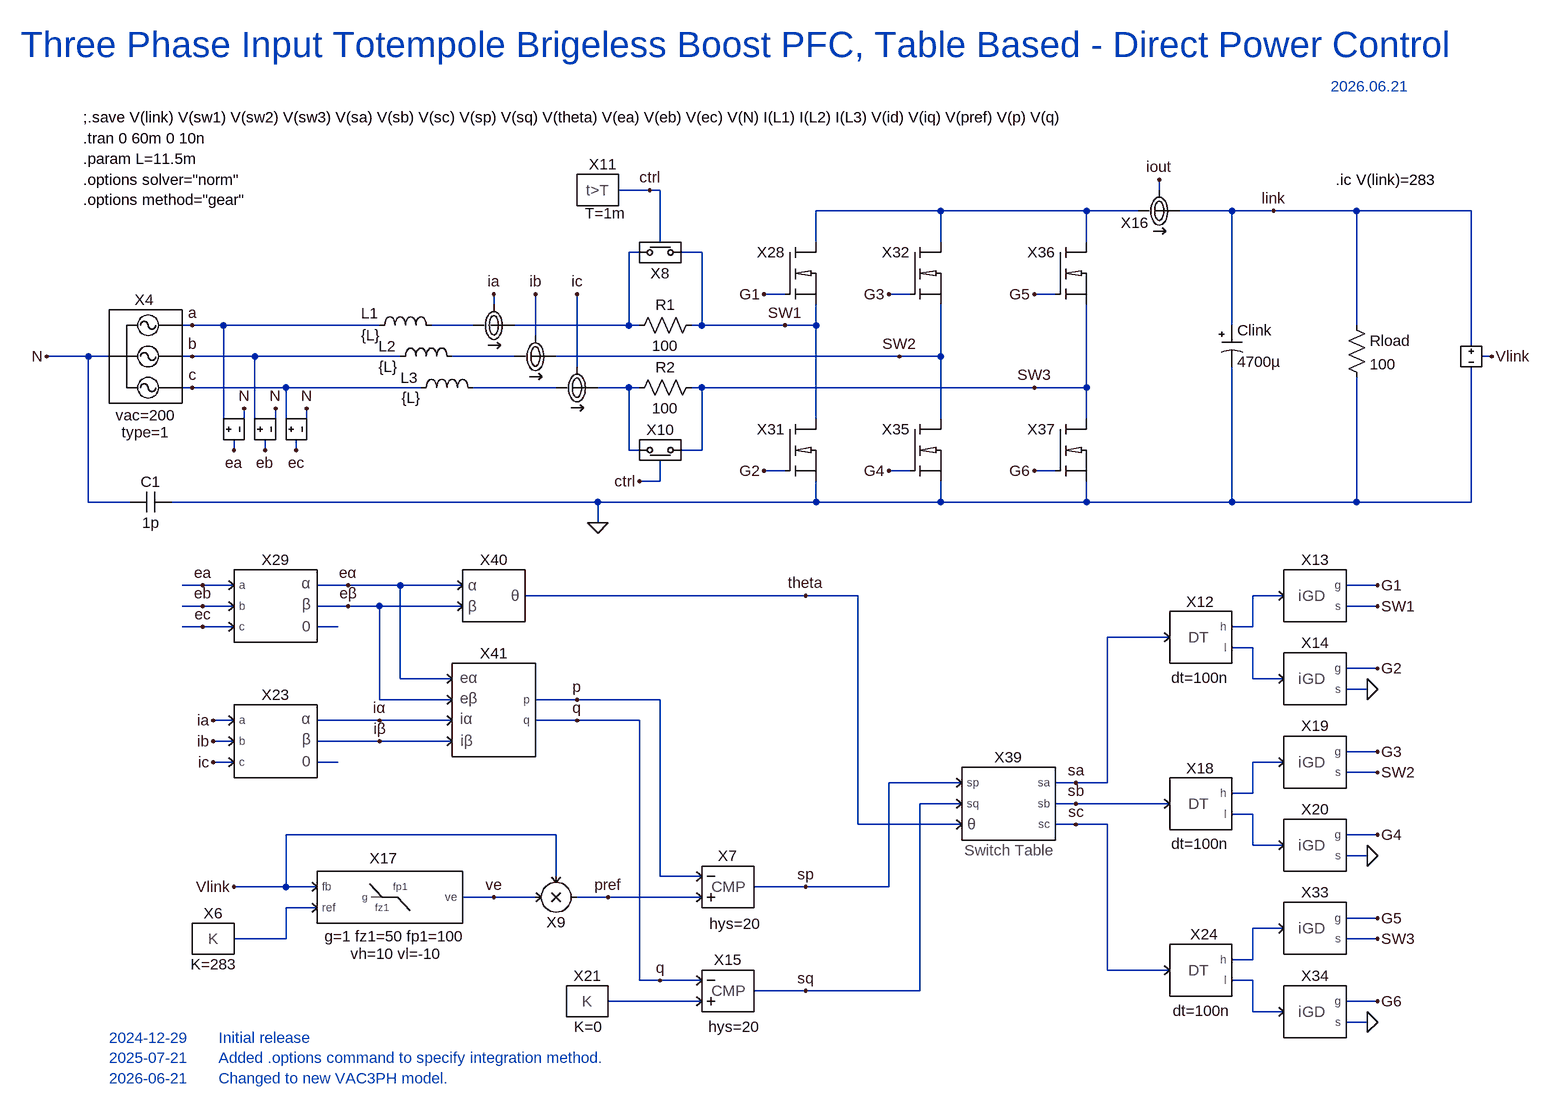
[diagram p0: schematic 3Ph-TTP-PFC_TB-DPC.asc]
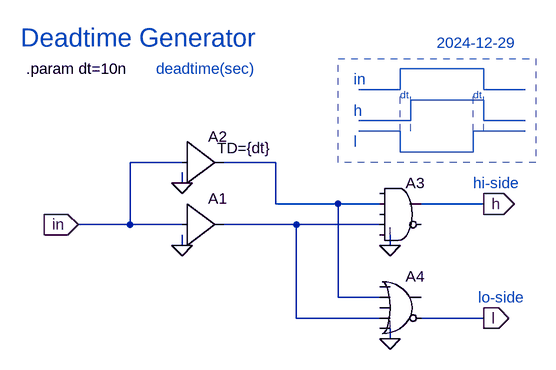
[diagram p1: sub-circuit deadtime.asc]
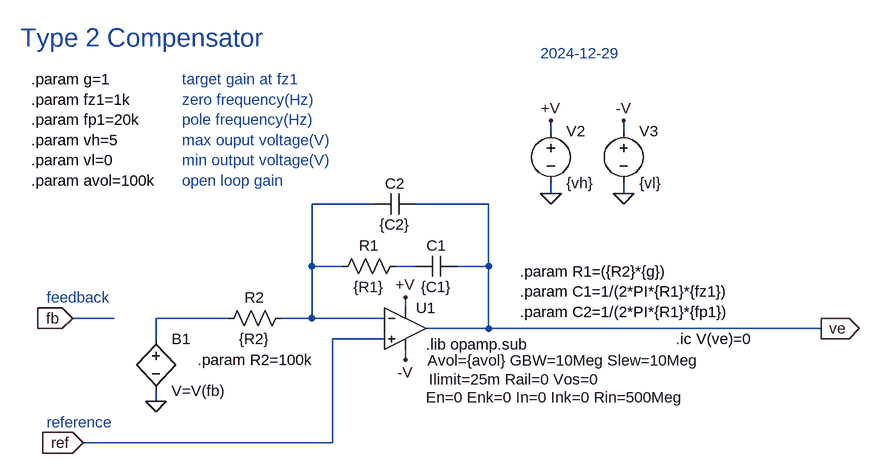
[diagram p2: sub-circuit type2.asc]
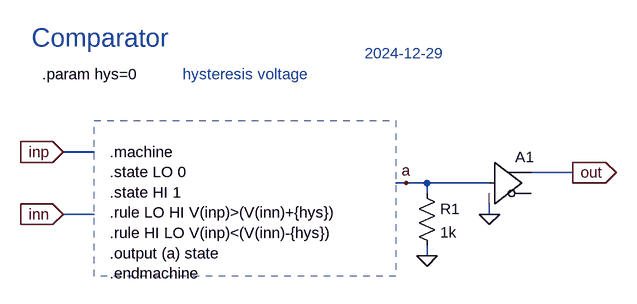
[diagram p3: sub-circuit cmp.asc]
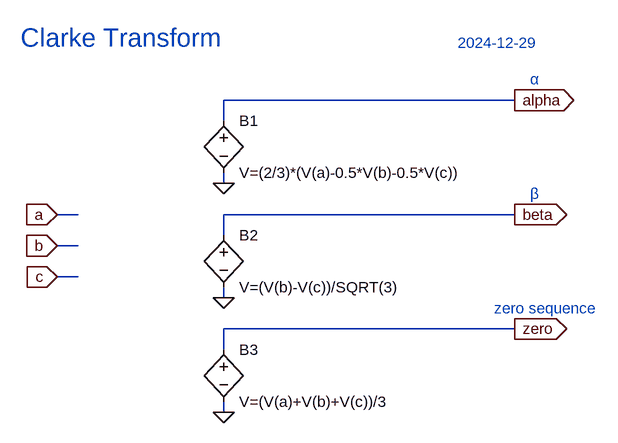
[diagram p4: sub-circuit clarke.asc]
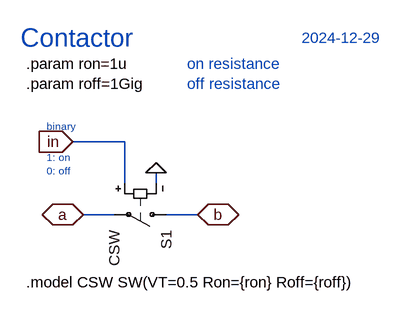
[diagram p5: sub-circuit contactor.asc]
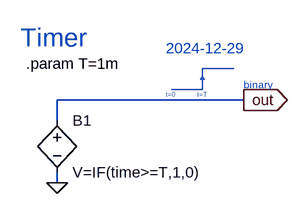
[diagram p6: sub-circuit timer.asc]
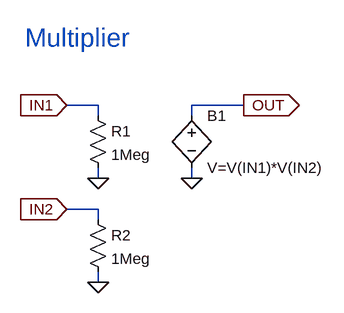
[diagram p7: sub-circuit mul.asc]
3Ph-TTP-PFC_TB-DPC.asc, the LTspice schematic file:
Version 4.1
SHEET 1 2416 2284
WIRE 336 -160 288 -160
WIRE 352 -160 336 -160
WIRE 1120 -160 1120 -176
WIRE 784 -128 592 -128
WIRE 1008 -128 784 -128
WIRE 1088 -128 1008 -128
WIRE 1232 -128 1152 -128
WIRE 1296 -128 1232 -128
WIRE 1424 -128 1296 -128
WIRE 1600 -128 1424 -128
WIRE 352 -80 352 -160
WIRE 592 -80 592 -128
WIRE 784 -80 784 -128
WIRE 1008 -80 1008 -128
WIRE 320 -64 304 -64
WIRE 416 -64 384 -64
WIRE 544 0 512 0
WIRE 736 0 704 0
WIRE 960 0 928 0
WIRE 96 16 96 0
WIRE -368 48 -384 48
WIRE -320 48 -368 48
WIRE -80 48 -320 48
WIRE 64 48 0 48
WIRE 304 48 304 -64
WIRE 304 48 128 48
WIRE 320 48 304 48
WIRE 416 48 416 -64
WIRE 416 48 400 48
WIRE 544 48 416 48
WIRE 592 48 592 16
WIRE 592 48 544 48
WIRE 1232 48 1232 -128
WIRE 1424 48 1424 -128
WIRE 160 64 160 0
WIRE 1600 80 1600 -128
WIRE -528 96 -592 96
WIRE -496 96 -528 96
WIRE -368 96 -384 96
WIRE -272 96 -368 96
WIRE -48 96 -272 96
WIRE 128 96 32 96
WIRE 720 96 192 96
WIRE 784 96 784 16
WIRE 784 96 720 96
WIRE 1632 96 1616 96
WIRE 224 112 224 0
WIRE -368 144 -384 144
WIRE -224 144 -368 144
WIRE -16 144 -224 144
WIRE 192 144 64 144
WIRE 304 144 256 144
WIRE 320 144 304 144
WIRE 416 144 400 144
WIRE 928 144 416 144
WIRE 1008 144 1008 16
WIRE 1008 144 928 144
WIRE 592 192 592 48
WIRE 784 192 784 96
WIRE 1008 192 1008 144
WIRE -320 208 -320 48
WIRE -288 208 -288 176
WIRE -272 208 -272 96
WIRE -240 208 -240 176
WIRE -224 208 -224 144
WIRE -192 208 -192 176
WIRE -304 240 -304 224
WIRE -256 240 -256 224
WIRE -208 240 -208 224
WIRE 304 240 304 144
WIRE 320 240 304 240
WIRE 416 240 416 144
WIRE 416 240 384 240
WIRE 544 272 512 272
WIRE 736 272 704 272
WIRE 960 272 928 272
WIRE 352 288 352 256
WIRE 352 288 320 288
WIRE -528 320 -528 96
WIRE -464 320 -528 320
WIRE 256 320 -400 320
WIRE 592 320 592 288
WIRE 592 320 256 320
WIRE 784 320 784 288
WIRE 784 320 592 320
WIRE 1008 320 1008 288
WIRE 1008 320 784 320
WIRE 1232 320 1232 112
WIRE 1232 320 1008 320
WIRE 1424 320 1424 128
WIRE 1424 320 1232 320
WIRE 1600 320 1600 112
WIRE 1600 320 1424 320
WIRE 256 352 256 320
WIRE -352 448 -384 448
WIRE -304 448 -352 448
WIRE -128 448 -176 448
WIRE -48 448 -128 448
WIRE 48 448 -48 448
WIRE 1456 448 1408 448
WIRE 576 464 144 464
WIRE 656 464 576 464
WIRE 1312 464 1264 464
WIRE -352 480 -384 480
WIRE -304 480 -352 480
WIRE -128 480 -176 480
WIRE -80 480 -128 480
WIRE 48 480 -80 480
WIRE 1456 480 1408 480
WIRE -352 512 -384 512
WIRE -304 512 -352 512
WIRE -144 512 -176 512
WIRE 1264 512 1264 464
WIRE 1264 512 1232 512
WIRE 1136 528 1040 528
WIRE 1264 544 1232 544
WIRE 1456 576 1408 576
WIRE -48 592 -48 448
WIRE 32 592 -48 592
WIRE 1264 592 1264 544
WIRE 1312 592 1264 592
WIRE 1440 608 1408 608
WIRE -80 624 -80 480
WIRE 32 624 -80 624
WIRE 224 624 160 624
WIRE 352 624 224 624
WIRE -304 656 -336 656
WIRE -80 656 -176 656
WIRE 32 656 -80 656
WIRE 224 656 160 656
WIRE 320 656 224 656
WIRE -304 688 -336 688
WIRE -80 688 -176 688
WIRE 32 688 -80 688
WIRE 1456 704 1408 704
WIRE -304 720 -336 720
WIRE -144 720 -176 720
WIRE 1312 720 1264 720
WIRE 1456 736 1408 736
WIRE 816 752 704 752
WIRE 992 752 960 752
WIRE 1040 752 1040 528
WIRE 1040 752 992 752
WIRE 1264 768 1264 720
WIRE 1264 768 1232 768
WIRE 816 784 752 784
WIRE 992 784 960 784
WIRE 1136 784 992 784
WIRE 1264 800 1232 800
WIRE 656 816 656 464
WIRE 816 816 656 816
WIRE 992 816 960 816
WIRE 1040 816 992 816
WIRE 192 832 -224 832
WIRE 1456 832 1408 832
WIRE 1264 848 1264 800
WIRE 1312 848 1264 848
WIRE 1440 864 1408 864
WIRE 192 896 192 832
WIRE 352 896 352 624
WIRE 416 896 352 896
WIRE -224 912 -224 832
WIRE -224 912 -304 912
WIRE -176 912 -224 912
WIRE 576 912 496 912
WIRE 704 912 704 752
WIRE 704 912 576 912
WIRE 96 928 48 928
WIRE 160 928 96 928
WIRE 272 928 224 928
WIRE 416 928 272 928
WIRE -176 944 -224 944
WIRE 1456 960 1408 960
WIRE 1312 976 1264 976
WIRE -224 992 -224 944
WIRE -224 992 -304 992
WIRE 1456 992 1408 992
WIRE 1264 1024 1264 976
WIRE 1264 1024 1232 1024
WIRE 1040 1040 1040 816
WIRE 1136 1040 1040 1040
WIRE 320 1056 320 656
WIRE 352 1056 320 1056
WIRE 416 1056 352 1056
WIRE 1264 1056 1232 1056
WIRE 576 1072 496 1072
WIRE 752 1072 752 784
WIRE 752 1072 576 1072
WIRE 416 1088 272 1088
WIRE 1456 1088 1408 1088
WIRE 1264 1104 1264 1056
WIRE 1312 1104 1264 1104
WIRE 1440 1120 1408 1120
FLAG 512 0 G1
FLAG 512 272 G2
FLAG 544 48 SW1
FLAG 1296 -128 link
FLAG 96 0 ia
FLAG 1632 96 Vlink
FLAG 256 352 0
FLAG 1120 -176 iout
FLAG 704 0 G3
FLAG 704 272 G4
FLAG 720 96 SW2
FLAG 928 0 G5
FLAG 928 272 G6
FLAG 928 144 SW3
FLAG 160 0 ib
FLAG -368 48 a
FLAG -368 96 b
FLAG -368 144 c
FLAG -592 96 N
FLAG 1456 448 G1
FLAG 1456 480 SW1
FLAG 1456 576 G2
FLAG 1456 704 G3
FLAG 1456 736 SW2
FLAG 1456 832 G4
FLAG 1456 960 G5
FLAG 1456 992 SW3
FLAG 1456 1088 G6
FLAG 1440 608 0
FLAG 1440 1120 0
FLAG 1440 864 0
FLAG 992 752 sa
FLAG 992 784 sb
FLAG 992 816 sc
FLAG -304 912 Vlink
FLAG 96 928 ve
FLAG 272 928 pref
FLAG 352 1056 q
FLAG 576 1072 sq
FLAG 576 912 sp
FLAG 224 0 ic
FLAG -336 656 ia
FLAG -336 688 ib
FLAG -336 720 ic
FLAG -80 656 iα
FLAG -80 688 iβ
FLAG -304 240 ea
FLAG -256 240 eb
FLAG -208 240 ec
FLAG -352 448 ea
FLAG -352 480 eb
FLAG -352 512 ec
FLAG -128 448 eα
FLAG -128 480 eβ
FLAG 224 624 p
FLAG 224 656 q
FLAG 336 -160 ctrl
FLAG 320 288 ctrl
FLAG -288 176 N
FLAG -240 176 N
FLAG -192 176 N
FLAG 576 464 theta
SYMBOL ind -96 64 R270
WINDOW 0 19 1 VTop 2
WINDOW 3 16 3 VBottom 2
SYMATTR InstName L1
SYMATTR Value {L}
SYMATTR SpiceLine Rser=0.2
SYMBOL polcap 1216 48 R0
WINDOW 3 24 56 Left 2
SYMATTR Value 4700µ
SYMATTR InstName Clink
SYMATTR Description Capacitor
SYMATTR Type cap
SYMATTR SpiceLine Rser=10m
SYMBOL res 1408 32 R0
SYMATTR InstName Rload
SYMATTR Value 100
SYMBOL IMON 96 48 M180
WINDOW 0 0 -26 Invisible 2
SYMATTR InstName X1
SYMBOL VMON 1600 96 R0
WINDOW 0 57 -5 Invisible 2
SYMATTR InstName X2
SYMBOL IMON 1120 -128 M180
SYMATTR InstName X16
SYMBOL ind -64 112 R270
WINDOW 0 16 -4 VTop 2
WINDOW 3 16 -2 VBottom 2
SYMATTR InstName L2
SYMATTR Value {L}
SYMATTR SpiceLine Rser=1m
SYMBOL ind -32 160 R270
WINDOW 0 16 -2 VTop 2
WINDOW 3 16 1 VBottom 2
SYMATTR InstName L3
SYMATTR Value {L}
SYMATTR SpiceLine Rser=1m
SYMBOL IMON 160 96 M180
WINDOW 0 0 -26 Invisible 2
SYMATTR InstName X3
SYMBOL DEADTIME 1184 528 R0
WINDOW 0 -1 -70 Top 2
WINDOW 39 -1 47 Top 2
SYMATTR InstName X12
SYMATTR SpiceLine dt=100n
SYMBOL iGD 1360 464 R0
SYMATTR InstName X13
SYMBOL iGD 1360 592 R0
SYMATTR InstName X14
SYMBOL DEADTIME 1184 784 R0
WINDOW 0 -1 -70 Top 2
WINDOW 39 -1 46 Top 2
SYMATTR InstName X18
SYMATTR SpiceLine dt=100n
SYMBOL iGD 1360 720 R0
SYMATTR InstName X19
SYMBOL iGD 1360 848 R0
SYMATTR InstName X20
SYMBOL DEADTIME 1184 1040 R0
WINDOW 0 5 -71 Top 2
WINDOW 39 1 47 Top 2
SYMATTR InstName X24
SYMATTR SpiceLine dt=100n
SYMBOL iGD 1360 976 R0
SYMATTR InstName X33
SYMBOL iGD 1360 1104 R0
SYMATTR InstName X34
SYMBOL CONST -336 992 R0
WINDOW 39 1 55 Bottom 2
SYMATTR SpiceLine K=283
SYMATTR InstName X6
SYMBOL TYPE2 -64 928 R0
WINDOW 0 -10 -60 Center 2
WINDOW 39 8 60 Center 2
WINDOW 40 10 87 Center 2
SYMATTR InstName X17
SYMATTR SpiceLine g=1 fz1=50 fp1=100
SYMATTR SpiceLine2 vh=10 vl=-10
SYMBOL CONST 240 1088 R0
WINDOW 39 1 55 Bottom 2
SYMATTR SpiceLine K=0
SYMATTR InstName X21
SYMBOL CMP 464 912 R0
WINDOW 39 3 72 Bottom 2
SYMATTR SpiceLine hys=20
SYMATTR InstName X7
SYMBOL CMP 464 1072 R0
WINDOW 39 2 71 Bottom 2
SYMATTR SpiceLine hys=20
SYMATTR InstName X15
SYMBOL IMON 224 144 M180
WINDOW 0 0 -26 Invisible 2
SYMATTR InstName X22
SYMBOL CLARKE -240 688 R0
SYMATTR InstName X23
SYMBOL VMON -304 208 M90
WINDOW 0 57 -5 Invisible 2
SYMATTR InstName X25
SYMBOL VMON -256 208 M90
WINDOW 0 57 -5 Invisible 2
SYMATTR InstName X26
SYMBOL VMON -208 208 M90
WINDOW 0 57 -5 Invisible 2
SYMATTR InstName X27
SYMBOL CLARKE -240 480 R0
SYMATTR InstName X29
SYMBOL res 416 32 R90
WINDOW 0 0 56 VBottom 2
WINDOW 3 32 56 VTop 2
SYMATTR InstName R1
SYMATTR Value 100
SYMBOL res 416 128 R90
WINDOW 0 0 56 VBottom 2
WINDOW 3 32 56 VTop 2
SYMATTR InstName R2
SYMATTR Value 100
SYMBOL CONTACTOR 352 -80 R0
SYMATTR InstName X8
SYMBOL CONTACTOR 352 256 R180
SYMATTR InstName X10
SYMBOL TIMER 256 -160 R0
WINDOW 39 12 51 Bottom 2
SYMATTR InstName X11
SYMBOL MUL 192 928 M180
SYMATTR InstName X9
SYMBOL iNMOS 592 -32 R0
SYMATTR InstName X28
SYMBOL iNMOS 592 240 R0
SYMATTR InstName X31
SYMBOL iNMOS 784 -32 R0
SYMATTR InstName X32
SYMBOL iNMOS 784 240 R0
SYMATTR InstName X35
SYMBOL iNMOS 1008 -32 R0
SYMATTR InstName X36
SYMBOL iNMOS 1008 240 R0
SYMATTR InstName X37
SYMBOL PowerSim\\SWTABLE 880 784 R0
SYMATTR InstName X39
SYMBOL PowerSim\\ANGLE 96 464 R0
SYMATTR InstName X40
SYMBOL PowerSim\\PQ_POWER 96 640 R0
SYMATTR InstName X41
SYMBOL cap -400 304 R90
WINDOW 0 0 32 VBottom 2
WINDOW 3 32 32 VTop 2
SYMATTR InstName C1
SYMATTR Value 1p
SYMBOL PowerSim\\VAC3PH -432 96 R0
WINDOW 39 -8 106 Bottom 2
WINDOW 3 -8 132 Bottom 2
SYMATTR InstName X4
SYMATTR SpiceLine vac=200
SYMATTR Value type=1
TEXT -632 -384 Left 5 ;Three Phase Input Totempole Brigeless Boost PFC, Table Based - Direct Power Control
TEXT -536 -240 Left 2 !.tran 0 60m 0 10n
TEXT 1392 -176 Left 2 !.ic V(link)=283
TEXT -536 -272 Left 2 !;.save V(link) V(sw1) V(sw2) V(sw3) V(sa) V(sb) V(sc) V(sp) V(sq) V(theta) V(ea) V(eb) V(ec) V(N) I(L1) I(L2) I(L3) V(id) V(iq) V(pref) V(p) V(q)
TEXT -536 -208 Left 2 !.param L=11.5m
TEXT 1384 -320 Left 2 ;2026.06.21
TEXT -536 -176 Left 2 !.options solver="norm"\n.options method="gear"
TEXT -496 1144 Left 2 ;2024-12-29       Initial release\n2025-07-21       Added .options command to specify integration method.\n2026-06-21       Changed to new VAC3PH model.

deadtime.asc, the sub-circuit schematic file:
Version 4
SHEET 1 1412 1312
WIRE 64 288 -16 288
WIRE 208 288 128 288
WIRE 64 320 64 304
WIRE 208 352 208 288
WIRE 304 352 208 352
WIRE 368 352 304 352
WIRE 528 352 432 352
WIRE -16 384 -16 288
WIRE -16 384 -96 384
WIRE 64 384 -16 384
WIRE 240 384 128 384
WIRE 368 384 240 384
WIRE 64 416 64 400
WIRE 384 416 384 400
WIRE 304 496 304 352
WIRE 368 496 304 496
WIRE 240 528 240 384
WIRE 368 528 240 528
WIRE 528 528 432 528
WIRE 384 560 384 544
FLAG -96 384 in
IOPIN -96 384 In
FLAG 64 416 0
FLAG 64 320 0
FLAG 384 416 0
FLAG 384 560 0
FLAG 528 352 h
IOPIN 528 352 Out
FLAG 528 528 l
IOPIN 528 528 Out
SYMBOL Digital\\buf1 64 320 R0
SYMATTR InstName A1
SYMBOL Digital\\buf1 64 224 R0
WINDOW 3 54 42 Left 2
SYMATTR Value TD={dt}
SYMATTR InstName A2
SYMBOL Digital\\and 400 304 R0
SYMATTR InstName A3
SYMBOL Digital\\or 400 448 R0
SYMATTR InstName A4
TEXT -176 144 Left 2 !.param dt=10n
TEXT -184 96 Left 4 ;Deadtime Generator
TEXT 24 144 Left 2 ;deadtime(sec)
TEXT 512 320 Left 2 ;hi-side
TEXT 520 496 Left 2 ;lo-side
TEXT 328 160 Left 2 ;in
TEXT 328 208 Left 2 ;h
TEXT 328 256 Left 2 ;l
TEXT 400 184 Left 1 ;dt
TEXT 512 184 Left 1 ;dt
TEXT 456 104 Left 2 ;2024-12-29
LINE Normal 400 176 336 176
LINE Normal 400 176 400 144
LINE Normal 528 144 400 144
LINE Normal 528 176 528 144
LINE Normal 592 176 528 176
LINE Normal 416 224 336 224
LINE Normal 416 224 416 192
LINE Normal 528 192 416 192
LINE Normal 528 224 528 192
LINE Normal 592 224 528 224
LINE Normal 400 240 336 240
LINE Normal 400 272 400 240
LINE Normal 512 272 400 272
LINE Normal 512 272 512 240
LINE Normal 592 240 512 240
LINE Normal 400 240 400 176 2
LINE Normal 512 240 512 176 2
LINE Normal 416 240 416 176 2
LINE Normal 528 240 528 176 2
RECTANGLE Normal 608 288 304 128 2

type2.asc, the sub-circuit schematic file:
Version 4
SHEET 1 1008 680
WIRE 464 -144 464 -160
WIRE 576 -144 576 -160
WIRE 464 -48 464 -64
WIRE 576 -48 576 -64
WIRE 192 -32 96 -32
WIRE 368 -32 256 -32
WIRE 96 64 96 -32
WIRE 144 64 96 64
WIRE 256 64 224 64
WIRE 368 64 368 -32
WIRE 368 64 320 64
WIRE 240 128 240 112
WIRE -208 144 -272 144
WIRE -32 144 -144 144
WIRE 96 144 96 64
WIRE 96 144 48 144
WIRE 208 144 96 144
WIRE 368 160 368 64
WIRE 368 160 272 160
WIRE 880 160 368 160
WIRE -144 176 -144 144
WIRE 208 176 128 176
WIRE 240 208 240 192
WIRE -144 272 -144 256
WIRE 128 336 128 176
WIRE 128 336 -256 336
FLAG -272 144 fb
IOPIN -272 144 In
FLAG -256 336 ref
IOPIN -256 336 In
FLAG -144 272 0
FLAG 880 160 ve
IOPIN 880 160 Out
FLAG 576 -48 0
FLAG 464 -48 0
FLAG 464 -160 +V
FLAG 576 -160 -V
FLAG 240 112 +V
FLAG 240 208 -V
SYMBOL res 240 48 R90
WINDOW 0 0 56 VBottom 2
WINDOW 3 32 56 VTop 2
SYMATTR InstName R1
SYMATTR Value {R1}
SYMBOL cap 320 48 R90
WINDOW 0 0 32 VBottom 2
WINDOW 3 32 32 VTop 2
SYMATTR InstName C1
SYMATTR Value {C1}
SYMBOL cap 256 -48 R90
WINDOW 0 0 32 VBottom 2
WINDOW 3 32 32 VTop 2
SYMATTR InstName C2
SYMATTR Value {C2}
SYMBOL bv -144 160 R0
SYMATTR InstName B1
SYMATTR Value V=V(fb)
SYMBOL res 64 128 R90
WINDOW 0 0 56 VBottom 2
WINDOW 3 32 56 VTop 2
SYMATTR InstName R2
SYMATTR Value {R2}
SYMBOL UniversalOpAmp2 240 160 R0
WINDOW 123 34 49 Left 2
WINDOW 39 36 78 Left 2
WINDOW 40 32 106 Left 2
SYMATTR Value2 Avol={avol} GBW=10Meg Slew=10Meg
SYMATTR InstName U1
SYMBOL voltage 464 -160 R0
SYMATTR InstName V2
SYMATTR Value {vh}
SYMBOL voltage 576 -160 R0
SYMATTR InstName V3
SYMATTR Value {vl}
TEXT 272 184 Left 2 !.lib opamp.sub
TEXT -336 -224 Left 2 !.param g=1\n.param fz1=1k\n.param fp1=20k\n.param vh=5\n.param vl=0\n.param avol=100k
TEXT 416 72 Left 2 !.param R1=({R2}*{g})\n.param C1=1/(2*PI*{R1}*{fz1})\n.param C2=1/(2*PI*{R1}*{fp1})
TEXT -352 -288 Left 4 ;Type 2 Compensator
TEXT -80 208 Left 2 !.param R2=100k
TEXT -104 -224 Left 2 ;target gain at fz1\nzero frequency(Hz)\npole frequency(Hz)\nmax ouput voltage(V)\nmin output voltage(V)\nopen loop gain
TEXT -312 112 Left 2 ;feedback
TEXT -312 304 Left 2 ;reference
TEXT 656 176 Left 2 !.ic V(ve)=0
TEXT 448 -264 Left 2 ;2024-12-29

cmp.asc, the sub-circuit schematic file:
Version 4
SHEET 1 1276 680
WIRE 352 96 304 96
WIRE 1088 128 1024 128
WIRE 832 144 816 144
WIRE 864 144 832 144
WIRE 960 144 864 144
WIRE 864 160 864 144
WIRE 352 192 304 192
WIRE 960 192 960 176
WIRE 864 256 864 240
FLAG 304 96 inp
IOPIN 304 96 In
FLAG 304 192 inn
IOPIN 304 192 In
FLAG 1088 128 out
IOPIN 1088 128 Out
FLAG 864 256 0
FLAG 832 144 a
FLAG 960 192 0
SYMBOL res 848 144 R0
SYMATTR InstName R1
SYMATTR Value 1k
SYMBOL Digital\\buf 960 80 R0
SYMATTR InstName A1
TEXT 376 96 Left 2 !.machine\n.state LO 0\n.state HI 1\n.rule LO HI V(inp)>(V(inn)+{hys})\n.rule HI LO V(inp)<(V(inn)-{hys})\n.output (a) state\n.endmachine
TEXT 272 -24 Left 2 !.param hys=0
TEXT 256 -80 Left 4 ;Comparator
TEXT 488 -24 Left 2 ;hysteresis voltage
TEXT 768 -56 Left 2 ;2024-12-29
RECTANGLE Normal 816 288 352 48 2

clarke.asc, the sub-circuit schematic file:
Version 4
SHEET 1 880 680
WIRE 464 96 16 96
WIRE 16 128 16 96
WIRE 16 224 16 208
WIRE -208 272 -240 272
WIRE 464 272 16 272
WIRE 16 304 16 272
WIRE -208 320 -240 320
WIRE -208 368 -240 368
WIRE 16 400 16 384
WIRE 464 448 16 448
WIRE 16 480 16 448
WIRE 16 576 16 560
FLAG 16 224 0
FLAG 464 96 alpha
IOPIN 464 96 Out
FLAG -240 272 a
IOPIN -240 272 In
FLAG -240 320 b
IOPIN -240 320 In
FLAG -240 368 c
IOPIN -240 368 In
FLAG 16 400 0
FLAG 464 272 beta
IOPIN 464 272 Out
FLAG 16 576 0
FLAG 464 448 zero
IOPIN 464 448 Out
SYMBOL bv 16 112 R0
SYMATTR InstName B1
SYMATTR Value V=(2/3)*(V(a)-0.5*V(b)-0.5*V(c))
SYMBOL bv 16 288 R0
SYMATTR InstName B2
SYMATTR Value V=(V(b)-V(c))/SQRT(3)
SYMBOL bv 16 464 R0
SYMATTR InstName B3
SYMATTR Value V=(V(a)+V(b)+V(c))/3
TEXT -296 0 Left 4 ;Clarke Transform
TEXT 432 416 Left 2 ;zero sequence
TEXT 488 64 Left 2 ;α
TEXT 488 240 Left 2 ;β
TEXT 376 8 Left 2 ;2024-12-29

contactor.asc, the sub-circuit schematic file:
Version 4
SHEET 1 1504 680
WIRE 416 128 336 128
WIRE 416 192 416 128
WIRE 464 192 464 176
WIRE 400 240 352 240
WIRE 528 240 480 240
FLAG 352 240 a
IOPIN 352 240 BiDir
FLAG 528 240 b
IOPIN 528 240 BiDir
FLAG 336 128 in
IOPIN 336 128 In
FLAG 464 176 0
SYMBOL sw 496 240 R90
SYMATTR InstName S1
SYMATTR Value CSW
SYMATTR Prefix SW
TEXT 264 8 Left 2 !.param ron=1u\n.param roff=1Gig
TEXT 264 344 Left 2 !.model CSW SW(VT=0.5 Ron={ron} Roff={roff})
TEXT 256 -32 Left 4 ;Contactor
TEXT 512 8 Left 2 ;on resistance\noff resistance
TEXT 296 104 Left 1 ;binary
TEXT 296 152 Left 1 ;1: on\n0: off
TEXT 688 -32 Left 2 ;2024-12-29

timer.asc, the sub-circuit schematic file:
Version 4
SHEET 1 1328 680
WIRE 1008 -128 720 -128
WIRE 720 -96 720 -128
WIRE 720 0 720 -16
FLAG 1008 -128 out
IOPIN 1008 -128 Out
FLAG 720 0 0
SYMBOL bv 720 -112 R0
SYMATTR InstName B1
SYMATTR Value V=IF(time>=T,1,0)
TEXT 672 -184 Left 2 !.param T=1m
TEXT 664 -224 Left 4 ;Timer
TEXT 1008 -152 Left 1 ;binary
TEXT 888 -136 Left 0 ;t=0
TEXT 936 -136 Left 0 ;t=T
TEXT 888 -208 Left 2 ;2024-12-29
LINE Normal 944 -144 896 -144
LINE Normal 944 -176 944 -144
LINE Normal 992 -176 944 -176
LINE Normal 947 -159 944 -163
LINE Normal 941 -159 944 -163

mul.asc, the sub-circuit schematic file:
Version 4
SHEET 1 880 680
WIRE 96 48 48 48
WIRE 320 48 240 48
WIRE 96 64 96 48
WIRE 240 64 240 48
WIRE 96 160 96 144
WIRE 240 160 240 144
WIRE 96 208 48 208
WIRE 96 224 96 208
WIRE 96 320 96 304
FLAG 48 48 IN1
IOPIN 48 48 In
FLAG 48 208 IN2
IOPIN 48 208 In
FLAG 240 160 0
FLAG 320 48 OUT
IOPIN 320 48 Out
FLAG 96 160 0
FLAG 96 320 0
SYMBOL bv 240 48 R0
SYMATTR InstName B1
SYMATTR Value V=V(IN1)*V(IN2)
SYMBOL res 80 48 R0
SYMATTR InstName R1
SYMATTR Value 1Meg
SYMBOL res 80 208 R0
SYMATTR InstName R2
SYMATTR Value 1Meg
TEXT -16 -56 Left 4 ;Multiplier

swtable.asc, the sub-circuit schematic file:
Version 4
SHEET 1 2892 2448
WIRE -640 -128 -720 -128
WIRE -384 -128 -416 -128
WIRE -640 -32 -720 -32
WIRE -384 -32 -416 -32
WIRE -384 64 -416 64
WIRE -640 96 -688 96
FLAG -720 -128 sp
IOPIN -720 -128 In
FLAG -720 -32 sq
IOPIN -720 -32 In
FLAG -688 96 theta
IOPIN -688 96 In
FLAG -384 -128 sa
IOPIN -384 -128 Out
FLAG -384 -32 sb
IOPIN -384 -32 Out
FLAG -384 64 sc
IOPIN -384 64 Out
TEXT -800 248 Left 2 !B1 sect1 0 V=(V(theta)>(11*PI/6))&((V(theta)<=(12*PI/6)))\nB2 sect2 0 V=(V(theta)>0)&((V(theta)<=(PI/6)))\nB3 sect3 0 V=(V(theta)>(PI/6))&((V(theta)<=(2*PI/6)))\nB4 sect4 0 V=(V(theta)>(2*PI/6))&((V(theta)<=(3*PI/6)))\nB5 sect5 0 V=(V(theta)>(3*PI/6))&((V(theta)<=(4*PI/6)))\nB6 sect6 0 V=(V(theta)>(4*PI/6))&((V(theta)<=(5*PI/6)))\nB7 sect7 0 V=(V(theta)>(5*PI/6))&((V(theta)<=(6*PI/6)))\nB8 sect8 0 V=(V(theta)>(6*PI/6))&((V(theta)<=(7*PI/6)))\nB9 sect9 0 V=(V(theta)>(7*PI/6))&((V(theta)<=(8*PI/6)))\nB10 sect10 0 V=(V(theta)>(8*PI/6))&((V(theta)<=(9*PI/6)))\nB11 sect11 0 V=(V(theta)>(9*PI/6))&((V(theta)<=(10*PI/6)))\nB12 sect12 0 V=(V(theta)>(10*PI/6))&((V(theta)<=(11*PI/6)))\n \nBa1 sa1 0 V=1\nBa2 sa2 0 V=1\nBa3 sa3 0 V=(V(sp)<0.5)|((V(sp)>0.5)&(V(sq)<0.5))\nBa4 sa4 0 V=((V(sp)<0.5)&(V(sq)<0.5))\nBa5 sa5 0 V=(V(sp)>0.5)|((V(sp)<0.5)&(V(sq)<0.5))\nBa6 sa6 0 V=(V(sp)>0.5)\nBa7 sa7 0 V=0\nBa8 sa8 0 V=0\nBa9 sa9 0 V=((V(sp)>0.5)&(V(sq)>0.5))\nBa10 sa10 0 V=(V(sp)>0.5)|((V(sp)<0.5)&(V(sq)>0.5))\nBa11 sa11 0 V=((V(sp)<0.5)&(V(sq)>0.5))\nBa12 sa12 0 V=(V(sp)<0.5)\n \nBb1 sb1 0 V=((V(sp)>0.5)&(V(sq)>0.5))\nBb2 sb2 0 V=(V(sp)>0.5)|((V(sp)<0.5)&(V(sq)>0.5))\nBb3 sb3 0 V=((V(sp)<0.5)&(V(sq)>0.5))\nBb4 sb4 0 V=(V(sp)<0.5)\nBb5 sb5 0 V=1\nBb6 sb6 0 V=1\nBb7 sb7 0 V=(V(sp)<0.5)|((V(sp)>0.5)&(V(sq)<0.5))\nBb8 sb8 0 V=((V(sp)<0.5)&(V(sq)<0.5))\nBb9 sb9 0 V=(V(sp)>0.5)|((V(sp)<0.5)&(V(sq)<0.5))\nBb10 sb10 0 V=(V(sp)>0.5)\nBb11 sb11 0 V=0\nBb12 sb12 0 V=0\n \nBc1 sc1 0 V=(V(sp)>0.5)|((V(sp)<0.5)&(V(sq)<0.5))\nBc2 sc2 0 V=(V(sp)>0.5)\nBc3 sc3 0 V=0\nBc4 sc4 0 V=0\nBc5 sc5 0 V=((V(sp)>0.5)&(V(sq)>0.5))\nBc6 sc6 0 V=(V(sp)>0.5)|((V(sp)<0.5)&(V(sq)>0.5))\nBc7 sc7 0 V=((V(sp)<0.5)&(V(sq)>0.5))\nBc8 sc8 0 V=(V(sp)<0.5)\nBc9 sc9 0 V=1\nBc10 sc10 0 V=1\nBc11 sc11 0 V=(V(sp)<0.5)|((V(sp)>0.5)&(V(sq)<0.5))\nBc12 sc12 0 V=((V(sp)<0.5)&(V(sq)<0.5))\n \nBsa sa 0 V=(V(sa1)&V(sect1))|(V(sa2)&V(sect2))|(V(sa3)&V(sect3))|(V(sa4)&V(sect4))|(V(sa5)&V(sect5))|(V(sa6)&V(sect6))|(V(sa7)&V(sect7))|(V(sa8)&V(sect8))|(V(sa9)&V(sect9))|(V(sa10)&V(sect10))|(V(sa11)&V(sect11))|(V(sa12)&V(sect12))\n \nBsb sb 0 V=(V(sb1)&V(sect1))|(V(sb2)&V(sect2))|(V(sb3)&V(sect3))|(V(sb4)&V(sect4))|(V(sb5)&V(sect5))|(V(sb6)&V(sect6))|(V(sb7)&V(sect7))|(V(sb8)&V(sect8))|(V(sb9)&V(sect9))|(V(sb10)&V(sect10))|(V(sb11)&V(sect11))|(V(sb12)&V(sect12))\n \nBsc sc 0 V=(V(sc1)&V(sect1))|(V(sc2)&V(sect2))|(V(sc3)&V(sect3))|(V(sc4)&V(sect4))|(V(sc5)&V(sect5))|(V(sc6)&V(sect6))|(V(sc7)&V(sect7))|(V(sc8)&V(sect8))|(V(sc9)&V(sect9))|(V(sc10)&V(sect10))|(V(sc11)&V(sect11))|(V(sc12)&V(sect12))
TEXT -776 -248 Left 4 ;Three Phase Switch Table
TEXT -768 -104 Left 1 ;binary
TEXT -768 -8 Left 1 ;binary
TEXT -776 64 Left 2 ;Angle(rad)
TEXT -384 -104 Left 1 ;binary
TEXT -384 -8 Left 1 ;binary
TEXT -384 88 Left 1 ;binary
TEXT -768 -160 Left 2 ;P input
TEXT -768 -64 Left 2 ;Q input
TEXT -400 -160 Left 2 ;A output
TEXT -400 -64 Left 2 ;B output
TEXT -400 32 Left 2 ;C output
TEXT -72 -240 Left 2 ;2024-12-29
TEXT 624 112 Left 2 ;α
TEXT 424 -88 Left 2 ;β
TEXT 552 144 Left 2 ;Θ1
TEXT 552 80 Left 2 ;Θ2
TEXT 504 24 Left 2 ;Θ3
TEXT 448 -8 Left 2 ;Θ4
TEXT 392 -8 Left 2 ;Θ5
TEXT 328 24 Left 2 ;Θ6
TEXT 288 80 Left 2 ;Θ7
TEXT 288 144 Left 2 ;Θ8
TEXT 320 208 Left 2 ;Θ9
TEXT 376 248 Left 2 ;Θ10
TEXT 448 248 Left 2 ;Θ11
TEXT 512 216 Left 2 ;Θ12
TEXT 136 400 Center 2 ;Sp
TEXT 184 400 Center 2 ;Sq
TEXT 240 400 Center 2 ;Θ1
TEXT 240 432 Center 2 ;101\n111\n101\n100
TEXT 136 440 Center 2 ;1
TEXT 136 496 Center 2 ;0
TEXT 304 400 Center 2 ;Θ2
TEXT 304 432 Center 2 ;111\n111\n100\n110
TEXT 368 400 Center 2 ;Θ3
TEXT 368 432 Center 2 ;100\n000\n100\n110
TEXT 432 400 Center 2 ;Θ4
TEXT 432 432 Center 2 ;000\n000\n110\n010
TEXT 496 400 Center 2 ;Θ5
TEXT 496 432 Center 2 ;110\n111\n110\n010
TEXT 560 400 Center 2 ;Θ6
TEXT 560 432 Center 2 ;111\n111\n010\n011
TEXT 624 400 Center 2 ;Θ7
TEXT 624 432 Center 2 ;010\n000\n010\n011
TEXT 688 400 Center 2 ;Θ8
TEXT 688 432 Center 2 ;000\n000\n011\n001
TEXT 752 400 Center 2 ;Θ9
TEXT 752 432 Center 2 ;011\n111\n011\n001
TEXT 816 400 Center 2 ;Θ10
TEXT 816 432 Center 2 ;111\n111\n001\n101
TEXT 880 400 Center 2 ;Θ11
TEXT 880 432 Center 2 ;001\n000\n001\n101
TEXT 184 432 Center 2 ;0\n1\n0\n1
TEXT 944 400 Center 2 ;Θ12
TEXT 944 432 Center 2 ;000\n000\n101\n100
LINE Normal 608 112 256 112
LINE Normal 432 288 432 -64
LINE Normal 336 -48 528 272 1
LINE Normal 272 16 592 208 1
LINE Normal 592 16 272 208 1
LINE Normal 528 -48 336 272 1
LINE Normal 976 384 112 384
LINE Normal 160 528 160 384
LINE Normal 976 416 112 416
LINE Normal 208 528 208 384
LINE Normal 976 528 112 528
LINE Normal 976 474 111 474
LINE Normal 976 445 160 445
LINE Normal 272 528 272 384
LINE Normal 336 528 336 384
LINE Normal 400 528 400 384
LINE Normal 464 528 464 384
LINE Normal 528 528 528 384
LINE Normal 592 528 592 384
LINE Normal 656 528 656 384
LINE Normal 720 528 720 384
LINE Normal 784 528 784 384
LINE Normal 848 528 848 384
LINE Normal 976 503 160 503
LINE Normal 912 528 912 384
RECTANGLE Normal -416 144 -640 -192 2

angle.asc, the sub-circuit schematic file:
Version 4
SHEET 1 880 680
WIRE -176 48 -240 48
WIRE -368 80 -400 80
WIRE -240 80 -240 48
WIRE -368 160 -400 160
WIRE -240 192 -240 160
WIRE 320 240 -240 240
WIRE -240 272 -240 240
WIRE -240 384 -240 352
FLAG -240 192 0
FLAG -176 48 atan
FLAG -240 384 0
FLAG 320 240 theta
IOPIN 320 240 Out
FLAG -400 80 alpha
IOPIN -400 80 In
FLAG -400 160 beta
IOPIN -400 160 In
SYMBOL bv -240 64 R0
SYMATTR InstName B1
SYMATTR Value V=atan2(V(beta),V(alpha))
SYMBOL bv -240 256 R0
SYMATTR InstName B2
SYMATTR Value V=IF(V(atan)>0,V(atan),V(atan)+2*PI)
TEXT -448 48 Left 2 ;α
TEXT -448 128 Left 2 ;β
TEXT -488 -24 Left 4 ;α-β Angle Calculator
TEXT 312 208 Left 2 ;angle(rad)
TEXT 120 -8 Left 2 ;2024-12-29

pq_power.asc, the sub-circuit schematic file:
Version 4.1
SHEET 1 1432 680
WIRE 592 208 96 208
WIRE 96 224 96 208
WIRE -32 256 -48 256
WIRE -32 320 -48 320
WIRE 96 320 96 304
WIRE -32 384 -48 384
WIRE 592 384 96 384
WIRE 96 400 96 384
WIRE -32 448 -48 448
WIRE 96 496 96 480
FLAG -48 256 ealpha
IOPIN -48 256 In
FLAG -48 320 ebeta
IOPIN -48 320 In
FLAG -48 384 ialpha
IOPIN -48 384 In
FLAG -48 448 ibeta
IOPIN -48 448 In
FLAG 96 320 0
FLAG 592 208 p
IOPIN 592 208 Out
FLAG 96 496 0
FLAG 592 384 q
IOPIN 592 384 Out
SYMBOL bv 96 208 R0
SYMATTR InstName B1
SYMATTR Value V={K}*(V(ealpha)*V(ialpha)+V(ebeta)*V(ibeta))
SYMBOL bv 96 384 R0
SYMATTR InstName B2
SYMATTR Value V={K}*(V(ebeta)*V(ialpha)-V(ealpha)*V(ibeta))
TEXT -88 40 Left 2 ;p=K*(eα*iα+eβ*iβ)\nq=K*(eβ*iα-eα*iβ)\nK = 1.5 for amplitude-invariant αβ inputs (defualt)\nK = 1.0 for power-invariant αβ inputs
TEXT -128 -64 Left 4 ;α-β Power Calculation
TEXT -112 224 Left 2 ;eα
TEXT -112 224 Left 2 ;eα
TEXT -112 288 Left 2 ;eβ
TEXT -112 352 Left 2 ;iα
TEXT -112 416 Left 2 ;iβ
TEXT 512 -8 Left 2 ;2026-06-27
TEXT -104 -16 Left 2 !.param K=1.5
TEXT -168 544 Left 2 ;<Revision History>\n2024-12-29: Initial version\n2026-06-27: Added K scaling factor for LTspicePowerSim's amplitude-invariant Clarke/Park convention.

vac3ph.asc, the sub-circuit schematic file:
Version 4.1
SHEET 1 1264 876
WIRE 128 112 64 112
WIRE 736 112 208 112
WIRE 64 224 64 112
WIRE 64 224 -32 224
WIRE 192 224 64 224
WIRE 736 224 272 224
WIRE 64 336 64 224
WIRE 256 336 64 336
WIRE 736 336 336 336
FLAG 736 112 U
IOPIN 736 112 BiDir
FLAG -32 224 n
IOPIN -32 224 BiDir
FLAG 736 336 W
IOPIN 736 336 BiDir
FLAG 736 224 V
IOPIN 736 224 BiDir
SYMBOL voltage 224 112 R90
WINDOW 3 35 -262 VRight 2
WINDOW 123 0 0 Left 0
WINDOW 39 0 0 Left 0
WINDOW 0 -22 -13 VRight 2
SYMATTR Value SINE(0 {Vamp} {freq})
SYMATTR InstName V1
SYMBOL voltage 288 224 R90
WINDOW 3 37 -350 VRight 2
WINDOW 123 0 0 Left 0
WINDOW 39 0 0 Left 0
WINDOW 0 -22 -9 VRight 2
SYMATTR Value SINE(0 {Vamp} {freq} 0 0 -120)
SYMATTR InstName V2
SYMBOL voltage 352 336 M270
WINDOW 3 -49 52 VLeft 2
WINDOW 123 0 0 Left 0
WINDOW 39 0 0 Left 0
WINDOW 0 26 25 VLeft 2
SYMATTR Value SINE(0 {Vamp} {freq} 0 0 120)
SYMATTR InstName V3
TEXT -80 -32 Left 2 !.param freq=60\n.param VAC=100\n.param TYPE=0
TEXT -80 -80 Left 4 ;Three Phase AC Power
TEXT -80 192 Left 2 ;Neutral
TEXT 64 432 Left 2 !.param Vamp={VAC*SQRT(2)/IF(TYPE==1,SQRT(3),1)}
TEXT 216 -32 Left 2 ;frequency(Hz)\nAC voltage(Vrms)\n0: phase-to-neutral, 1: line-to-line
TEXT 960 -40 Left 2 ;2026-06-21
TEXT -120 480 Left 2 ;<Revision History>\n2024-12-30: Initial version\n2026-01-12: Updated VAC3PH phase definitions to ensure positive (counter-clockwise) phase rotation.\n2026-06-21: \n - Corrected VAC3PH amplitude calculation by removing the 0.5 factor. \n - Added TYPE parameter. VAC can now be interpreted as either phase-to-neutral RMS or line-to-line RMS voltage.

The netlist it stands for:
* 3Ph-TTP-PFC_TB-DPC.asc
L1 a N003 {L} Rser=0.2
Clink link 0 4700µ Rser=10m
Rload link 0 100
X§X1 N002 ia N003 IMON rsns=10u  ; pins n out p
X§X2 0 Vlink link VMON  ; pins n out p
X§X16 link iout N001 IMON rsns=10u  ; pins n out p
L2 b N004 {L} Rser=1m
L3 c N005 {L} Rser=1m
X§X3 SW2 ib N004 IMON rsns=10u  ; pins n out p
X§X12 sa N009 N007 deadtime params: dt=100n
X§X13 N007 G1 SW1 iGD  ; pins in g s
X§X14 N009 G2 0 iGD  ; pins in g s
X§X18 sb N012 N011 deadtime params: dt=100n
X§X19 N011 G3 SW2 iGD  ; pins in g s
X§X20 N012 G4 0 iGD  ; pins in g s
X§X24 sc N015 N014 deadtime params: dt=100n
X§X33 N014 G5 SW3 iGD  ; pins in g s
X§X34 N015 G6 0 iGD  ; pins in g s
X§X6 N013 CONST K=283  ; pins K
X§X17 Vlink N013 ve type2 params: avol=100k g=1 fz1=50 fp1=100 vh=10 vl=-10
X§X21 N016 CONST K=0  ; pins K
X§X7 p pref sp cmp params: hys=20
X§X15 q N016 sq cmp params: hys=20
X§X22 N006 ic N005 IMON rsns=10u  ; pins n out p
X§X23 ia ib ic iα iβ N010 clarke
X§X25 N ea a VMON  ; pins n out p
X§X26 N eb b VMON  ; pins n out p
X§X27 N ec c VMON  ; pins n out p
X§X29 ea eb ec eα eβ N008 clarke
R1 SW1 N002 100
R2 SW3 N006 100
X§X8 ctrl N002 SW1 contactor params: ron=1u roff=1Gig
X§X10 ctrl SW3 N006 contactor params: ron=1u roff=1Gig
X§X11 ctrl timer params: T=1m
X§X9 ve Vlink pref mul
X§X28 N001 G1 SW1 iNMOS params: esl=1f rsnb=1k csnb=10p ron=10m  ; pins D G S
X§X31 SW1 G2 0 iNMOS params: esl=1f rsnb=1k csnb=10p ron=10m  ; pins D G S
X§X32 N001 G3 SW2 iNMOS params: esl=1f rsnb=1k csnb=10p ron=10m  ; pins D G S
X§X35 SW2 G4 0 iNMOS params: esl=1f rsnb=1k csnb=10p ron=10m  ; pins D G S
X§X36 N001 G5 SW3 iNMOS params: esl=1f rsnb=1k csnb=10p ron=10m  ; pins D G S
X§X37 SW3 G6 0 iNMOS params: esl=1f rsnb=1k csnb=10p ron=10m  ; pins D G S
X§X39 sp sq theta sa sb sc swtable
X§X40 eα eβ theta angle
X§X41 eα eβ iα iβ p q pq_power params: K=1.5
C1 0 N 1p
X§X4 N a b c vac3ph params: type=1 vac=200 freq=60

* block symbol definitions
.subckt deadtime in l h
A1 in 0 0 0 0 0 N002 0 BUF
A2 in 0 0 0 0 0 N001 0 BUF TD={dt}
A3 0 N001 0 N002 0 0 h 0 AND
A4 0 N001 0 N002 0 l 0 0 OR
.param dt=10n
* Deadtime Generator
* deadtime(sec)
* hi-side
* lo-side
* in
* h
* l
* dt
* dt
* 2024-12-29
.ends deadtime

.subckt type2 fb ref ve
R1 N002 N001 {R1}
C1 ve N002 {C1}
C2 ve N001 {C2}
B1 N003 0 V=V(fb)
R2 N001 N003 {R2}
XU1 ref N001 +V -V ve level2 Avol={avol} GBW=10Meg Slew=10Meg Ilimit=25m Rail=0 Vos=0 En=0 Enk=0 In=0 Ink=0 Rin=500Meg  ; pins In+ In- V+ V- OUT
V2 +V 0 {vh}
V3 -V 0 {vl}
.lib opamp.sub
.param g=1
.param fz1=1k
.param fp1=20k
.param vh=5
.param vl=0
.param avol=100k
.param R1=({R2}*{g})
.param C1=1/(2*PI*{R1}*{fz1})
.param C2=1/(2*PI*{R1}*{fp1})
* Type 2 Compensator
.param R2=100k
* target gain at fz1
* zero frequency(Hz)
* pole frequency(Hz)
* max ouput voltage(V)
* min output voltage(V)
* open loop gain
* feedback
* reference
.ic V(ve)=0
* 2024-12-29
.ends type2

.subckt cmp inn inp out
R1 a 0 1k
A1 a 0 0 0 0 0 out 0 BUF
.machine
.state LO 0
.state HI 1
.rule LO HI V(inp)>(V(inn)+{hys})
.rule HI LO V(inp)<(V(inn)-{hys})
.output (a) state
.endmachine
.param hys=0
* Comparator
* hysteresis voltage
* 2024-12-29
.ends cmp

.subckt clarke a b c alpha beta zero
B1 alpha 0 V=(2/3)*(V(a)-0.5*V(b)-0.5*V(c))
B2 beta 0 V=(V(b)-V(c))/SQRT(3)
B3 zero 0 V=(V(a)+V(b)+V(c))/3
* Clarke Transform
* zero sequence
* α
* β
* 2024-12-29
.ends clarke

.subckt contactor in a b
S1 b a in 0 CSW
.param ron=1u
.param roff=1Gig
.model CSW SW(VT=0.5 Ron={ron} Roff={roff})
* Contactor
* on resistance
* off resistance
* binary
* 1: on
* 0: off
* 2024-12-29
.ends contactor

.subckt timer out
B1 out 0 V=IF(time>=T,1,0)
.param T=1m
* Timer
* binary
* t=0
* t=T
* 2024-12-29
.ends timer

.subckt mul in1 in2 out
B1 OUT 0 V=V(IN1)*V(IN2)
R1 IN1 0 1Meg
R2 IN2 0 1Meg
* Multiplier
.ends mul

.subckt swtable sp sq theta sa sb sc
B1 sect1 0 V=(V(theta)>(11*PI/6))&((V(theta)<=(12*PI/6)))
B2 sect2 0 V=(V(theta)>0)&((V(theta)<=(PI/6)))
B3 sect3 0 V=(V(theta)>(PI/6))&((V(theta)<=(2*PI/6)))
B4 sect4 0 V=(V(theta)>(2*PI/6))&((V(theta)<=(3*PI/6)))
B5 sect5 0 V=(V(theta)>(3*PI/6))&((V(theta)<=(4*PI/6)))
B6 sect6 0 V=(V(theta)>(4*PI/6))&((V(theta)<=(5*PI/6)))
B7 sect7 0 V=(V(theta)>(5*PI/6))&((V(theta)<=(6*PI/6)))
B8 sect8 0 V=(V(theta)>(6*PI/6))&((V(theta)<=(7*PI/6)))
B9 sect9 0 V=(V(theta)>(7*PI/6))&((V(theta)<=(8*PI/6)))
B10 sect10 0 V=(V(theta)>(8*PI/6))&((V(theta)<=(9*PI/6)))
B11 sect11 0 V=(V(theta)>(9*PI/6))&((V(theta)<=(10*PI/6)))
B12 sect12 0 V=(V(theta)>(10*PI/6))&((V(theta)<=(11*PI/6)))
Ba1 sa1 0 V=1
Ba2 sa2 0 V=1
Ba3 sa3 0 V=(V(sp)<0.5)|((V(sp)>0.5)&(V(sq)<0.5))
Ba4 sa4 0 V=((V(sp)<0.5)&(V(sq)<0.5))
Ba5 sa5 0 V=(V(sp)>0.5)|((V(sp)<0.5)&(V(sq)<0.5))
Ba6 sa6 0 V=(V(sp)>0.5)
Ba7 sa7 0 V=0
Ba8 sa8 0 V=0
Ba9 sa9 0 V=((V(sp)>0.5)&(V(sq)>0.5))
Ba10 sa10 0 V=(V(sp)>0.5)|((V(sp)<0.5)&(V(sq)>0.5))
Ba11 sa11 0 V=((V(sp)<0.5)&(V(sq)>0.5))
Ba12 sa12 0 V=(V(sp)<0.5)
Bb1 sb1 0 V=((V(sp)>0.5)&(V(sq)>0.5))
Bb2 sb2 0 V=(V(sp)>0.5)|((V(sp)<0.5)&(V(sq)>0.5))
Bb3 sb3 0 V=((V(sp)<0.5)&(V(sq)>0.5))
Bb4 sb4 0 V=(V(sp)<0.5)
Bb5 sb5 0 V=1
Bb6 sb6 0 V=1
Bb7 sb7 0 V=(V(sp)<0.5)|((V(sp)>0.5)&(V(sq)<0.5))
Bb8 sb8 0 V=((V(sp)<0.5)&(V(sq)<0.5))
Bb9 sb9 0 V=(V(sp)>0.5)|((V(sp)<0.5)&(V(sq)<0.5))
Bb10 sb10 0 V=(V(sp)>0.5)
Bb11 sb11 0 V=0
Bb12 sb12 0 V=0
Bc1 sc1 0 V=(V(sp)>0.5)|((V(sp)<0.5)&(V(sq)<0.5))
Bc2 sc2 0 V=(V(sp)>0.5)
Bc3 sc3 0 V=0
Bc4 sc4 0 V=0
Bc5 sc5 0 V=((V(sp)>0.5)&(V(sq)>0.5))
Bc6 sc6 0 V=(V(sp)>0.5)|((V(sp)<0.5)&(V(sq)>0.5))
Bc7 sc7 0 V=((V(sp)<0.5)&(V(sq)>0.5))
Bc8 sc8 0 V=(V(sp)<0.5)
Bc9 sc9 0 V=1
Bc10 sc10 0 V=1
Bc11 sc11 0 V=(V(sp)<0.5)|((V(sp)>0.5)&(V(sq)<0.5))
Bc12 sc12 0 V=((V(sp)<0.5)&(V(sq)<0.5))
Bsa sa 0 V=(V(sa1)&V(sect1))|(V(sa2)&V(sect2))|(V(sa3)&V(sect3))|(V(sa4)&V(sect4))|(V(sa5)&V(sect5))|(V(sa6)&V(sect6))|(V(sa7)&V(sect7))|(V(sa8)&V(sect8))|(V(sa9)&V(sect9))|(V(sa10)&V(sect10))|(V(sa11)&V(sect11))|(V(sa12)&V(sect12))
Bsb sb 0 V=(V(sb1)&V(sect1))|(V(sb2)&V(sect2))|(V(sb3)&V(sect3))|(V(sb4)&V(sect4))|(V(sb5)&V(sect5))|(V(sb6)&V(sect6))|(V(sb7)&V(sect7))|(V(sb8)&V(sect8))|(V(sb9)&V(sect9))|(V(sb10)&V(sect10))|(V(sb11)&V(sect11))|(V(sb12)&V(sect12))
Bsc sc 0 V=(V(sc1)&V(sect1))|(V(sc2)&V(sect2))|(V(sc3)&V(sect3))|(V(sc4)&V(sect4))|(V(sc5)&V(sect5))|(V(sc6)&V(sect6))|(V(sc7)&V(sect7))|(V(sc8)&V(sect8))|(V(sc9)&V(sect9))|(V(sc10)&V(sect10))|(V(sc11)&V(sect11))|(V(sc12)&V(sect12))
* Three Phase Switch Table
* binary
* binary
* Angle(rad)
* binary
* binary
* binary
* P input
* Q input
* A output
* B output
* C output
* 2024-12-29
* α
* β
* Θ1
* Θ2
* Θ3
* Θ4
* Θ5
* Θ6
* Θ7
* Θ8
* Θ9
* Θ10
* Θ11
* Θ12
* Sp
* Sq
* Θ1
* 101
* 111
* 101
* 100
* 1
* 0
* Θ2
* 111
* 111
* 100
* 110
* Θ3
* 100
* 000
* 100
* 110
* Θ4
* 000
* 000
* 110
* 010
* Θ5
* 110
* 111
* 110
* 010
* Θ6
* 111
* 111
* 010
* 011
* Θ7
* 010
* 000
* 010
* 011
* Θ8
* 000
* 000
* 011
* 001
* Θ9
* 011
* 111
* 011
* 001
* Θ10
* 111
* 111
* 001
* 101
* Θ11
* 001
* 000
* 001
* 101
* 0
* 1
* 0
* 1
* Θ12
* 000
* 000
* 101
* 100
.ends swtable

.subckt angle alpha beta theta
B1 atan 0 V=atan2(V(beta),V(alpha))
B2 theta 0 V=IF(V(atan)>0,V(atan),V(atan)+2*PI)
* α
* β
* α-β Angle Calculator
* angle(rad)
* 2024-12-29
.ends angle

.subckt pq_power ealpha ebeta ialpha ibeta p q
B1 p 0 V={K}*(V(ealpha)*V(ialpha)+V(ebeta)*V(ibeta))
B2 q 0 V={K}*(V(ebeta)*V(ialpha)-V(ealpha)*V(ibeta))
* p=K*(eα*iα+eβ*iβ)
* q=K*(eβ*iα-eα*iβ)
* K = 1.5 for amplitude-invariant αβ inputs (defualt)
* K = 1.0 for power-invariant αβ inputs
* α-β Power Calculation
* eα
* eα
* eβ
* iα
* iβ
* 2026-06-27
.param K=1.5
* <Revision History>
* 2024-12-29: Initial version
* 2026-06-27: Added K scaling factor for LTspicePowerSim's amplitude-invariant Clarke/Park convention.
.ends pq_power

.subckt vac3ph n U V W
V1 U n SINE(0 {Vamp} {freq})
V2 V n SINE(0 {Vamp} {freq} 0 0 -120)
V3 W n SINE(0 {Vamp} {freq} 0 0 120)
.param freq=60
.param VAC=100
.param TYPE=0
* Three Phase AC Power
* Neutral
.param Vamp={VAC*SQRT(2)/IF(TYPE==1,SQRT(3),1)}
* frequency(Hz)
* AC voltage(Vrms)
* 0: phase-to-neutral, 1: line-to-line
* 2026-06-21
* <Revision History>
* 2024-12-30: Initial version
* 2026-01-12: Updated VAC3PH phase definitions to ensure positive (counter-clockwise) phase rotation.
* 2026-06-21:
*  - Corrected VAC3PH amplitude calculation by removing the 0.5 factor.
*  - Added TYPE parameter. VAC can now be interpreted as either phase-to-neutral RMS or line-to-line RMS voltage.
.ends vac3ph

* Three Phase Input Totempole Brigeless Boost PFC, Table Based - Direct Power Control
.tran 0 60m 0 10n
.ic V(link)=283
;.save V(link) V(sw1) V(sw2) V(sw3) V(sa) V(sb) V(sc) V(sp) V(sq) V(theta) V(ea) V(eb) V(ec) V(N) I(L1) I(L2) I(L3) V(id) V(iq) V(pref) V(p) V(q)
.param L=11.5m
* 2026.06.21
.options solver="norm"
.options method="gear"
* 2024-12-29       Initial release
* 2025-07-21       Added .options command to specify integration method.
* 2026-06-21       Changed to new VAC3PH model.
.lib UniversalOpAmp2.lib
.backanno
.end